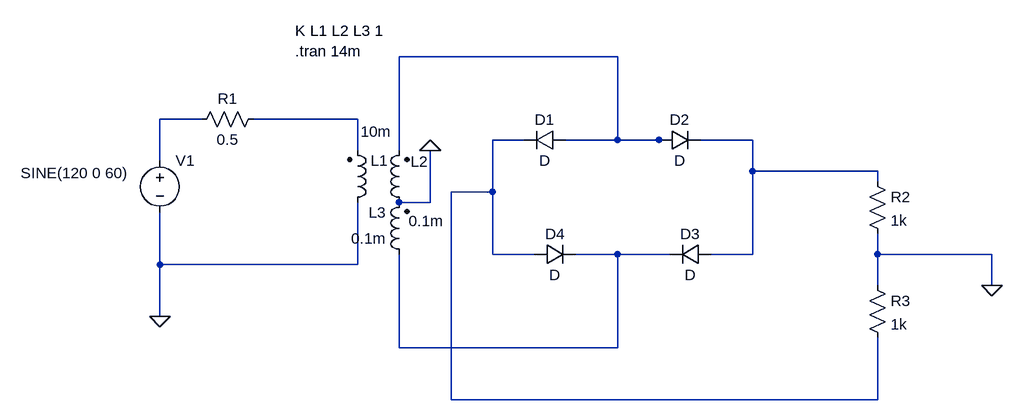
[diagram p0: schematic 3.6.asc]
3.6.asc, the LTspice schematic file:
Version 4
SHEET 1 1364 820
WIRE 384 -320 48 -320
WIRE -256 -224 -320 -224
WIRE -16 -224 -176 -224
WIRE 240 -192 192 -192
WIRE 384 -192 384 -320
WIRE 384 -192 304 -192
WIRE 448 -192 384 -192
WIRE 464 -192 448 -192
WIRE 592 -192 512 -192
WIRE -16 -176 -16 -224
WIRE 48 -176 48 -320
WIRE -320 -160 -320 -224
WIRE 592 -144 592 -192
WIRE 784 -144 592 -144
WIRE 784 -128 784 -144
WIRE 192 -112 192 -192
WIRE 192 -112 128 -112
WIRE 96 -96 96 -176
WIRE 96 -96 48 -96
WIRE 192 -16 192 -112
WIRE 256 -16 192 -16
WIRE 384 -16 320 -16
WIRE 464 -16 384 -16
WIRE 592 -16 592 -144
WIRE 592 -16 528 -16
WIRE 784 -16 784 -48
WIRE 960 -16 784 -16
WIRE -320 0 -320 -80
WIRE -16 0 -16 -96
WIRE -16 0 -320 0
WIRE 784 32 784 -16
WIRE 960 32 960 -16
WIRE -320 80 -320 0
WIRE 48 128 48 -16
WIRE 384 128 384 -16
WIRE 384 128 48 128
WIRE 128 208 128 -112
WIRE 784 208 784 112
WIRE 784 208 128 208
FLAG -320 80 0
FLAG 960 32 0
FLAG 96 -176 0
SYMBOL res -160 -240 R90
WINDOW 0 0 56 VBottom 2
WINDOW 3 32 56 VTop 2
SYMATTR InstName R1
SYMATTR Value 0.5
SYMBOL ind2 -32 -80 M180
WINDOW 0 36 80 Left 2
WINDOW 3 21 125 Left 2
SYMATTR InstName L1
SYMATTR Value 10m
SYMATTR Type ind
SYMBOL ind2 64 -80 R180
WINDOW 0 -29 79 Left 2
WINDOW 3 -53 -13 Left 2
SYMATTR InstName L2
SYMATTR Value 0.1m
SYMATTR Type ind
SYMBOL voltage -320 -176 R0
WINDOW 3 -214 35 Left 2
WINDOW 123 0 0 Left 2
WINDOW 39 0 0 Left 2
SYMATTR Value SINE(120 0 60)
SYMATTR InstName V1
SYMBOL diode 304 -208 R90
WINDOW 0 0 32 VBottom 2
WINDOW 3 32 32 VTop 2
SYMATTR InstName D1
SYMBOL diode 448 -176 R270
WINDOW 0 32 32 VTop 2
WINDOW 3 0 32 VBottom 2
SYMATTR InstName D2
SYMBOL diode 528 -32 R90
WINDOW 0 0 32 VBottom 2
WINDOW 3 32 32 VTop 2
SYMATTR InstName D3
SYMBOL diode 256 0 R270
WINDOW 0 32 32 VTop 2
WINDOW 3 0 32 VBottom 2
SYMATTR InstName D4
SYMBOL res 768 -144 R0
SYMATTR InstName R2
SYMATTR Value 1k
SYMBOL res 768 16 R0
SYMATTR InstName R3
SYMATTR Value 1k
SYMBOL ind2 64 0 R180
WINDOW 0 36 80 Left 2
WINDOW 3 36 40 Left 2
SYMATTR InstName L3
SYMATTR Value 0.1m
SYMATTR Type ind
TEXT -112 -360 Left 2 !K L1 L2 L3 1\n.tran 14m

The netlist it stands for:
* 3.6.asc
R1 N003 N002 0.5
L1 0 N003 10m
L2 0 N001 0.1m
V1 N002 0 SINE(120 0 60)
D1 N001 N004 D
D2 N001 N005 D
D3 N005 N006 D
D4 N004 N006 D
R2 N005 0 1k
R3 0 N004 1k
L3 N006 0 0.1m
.model D D
.lib standard.dio
K L1 L2 L3 1
.tran 14m
.backanno
.end